# EasyEDA Pro project ProPrj_Desktop_Pet_Dog_V1.3.epro, schematic Schematic1_1
Board Name: Board2_1; Create Date: 2025-08-21; Page Name: Desktop_Pet_P1; Project Name: Desktop_Pet_Dog_V1.2; Schematic Name: Schematic1_1; Update Date: 2025-08-22; Company: 嘉立创EDA; Page Size: A4; Version: V1.0
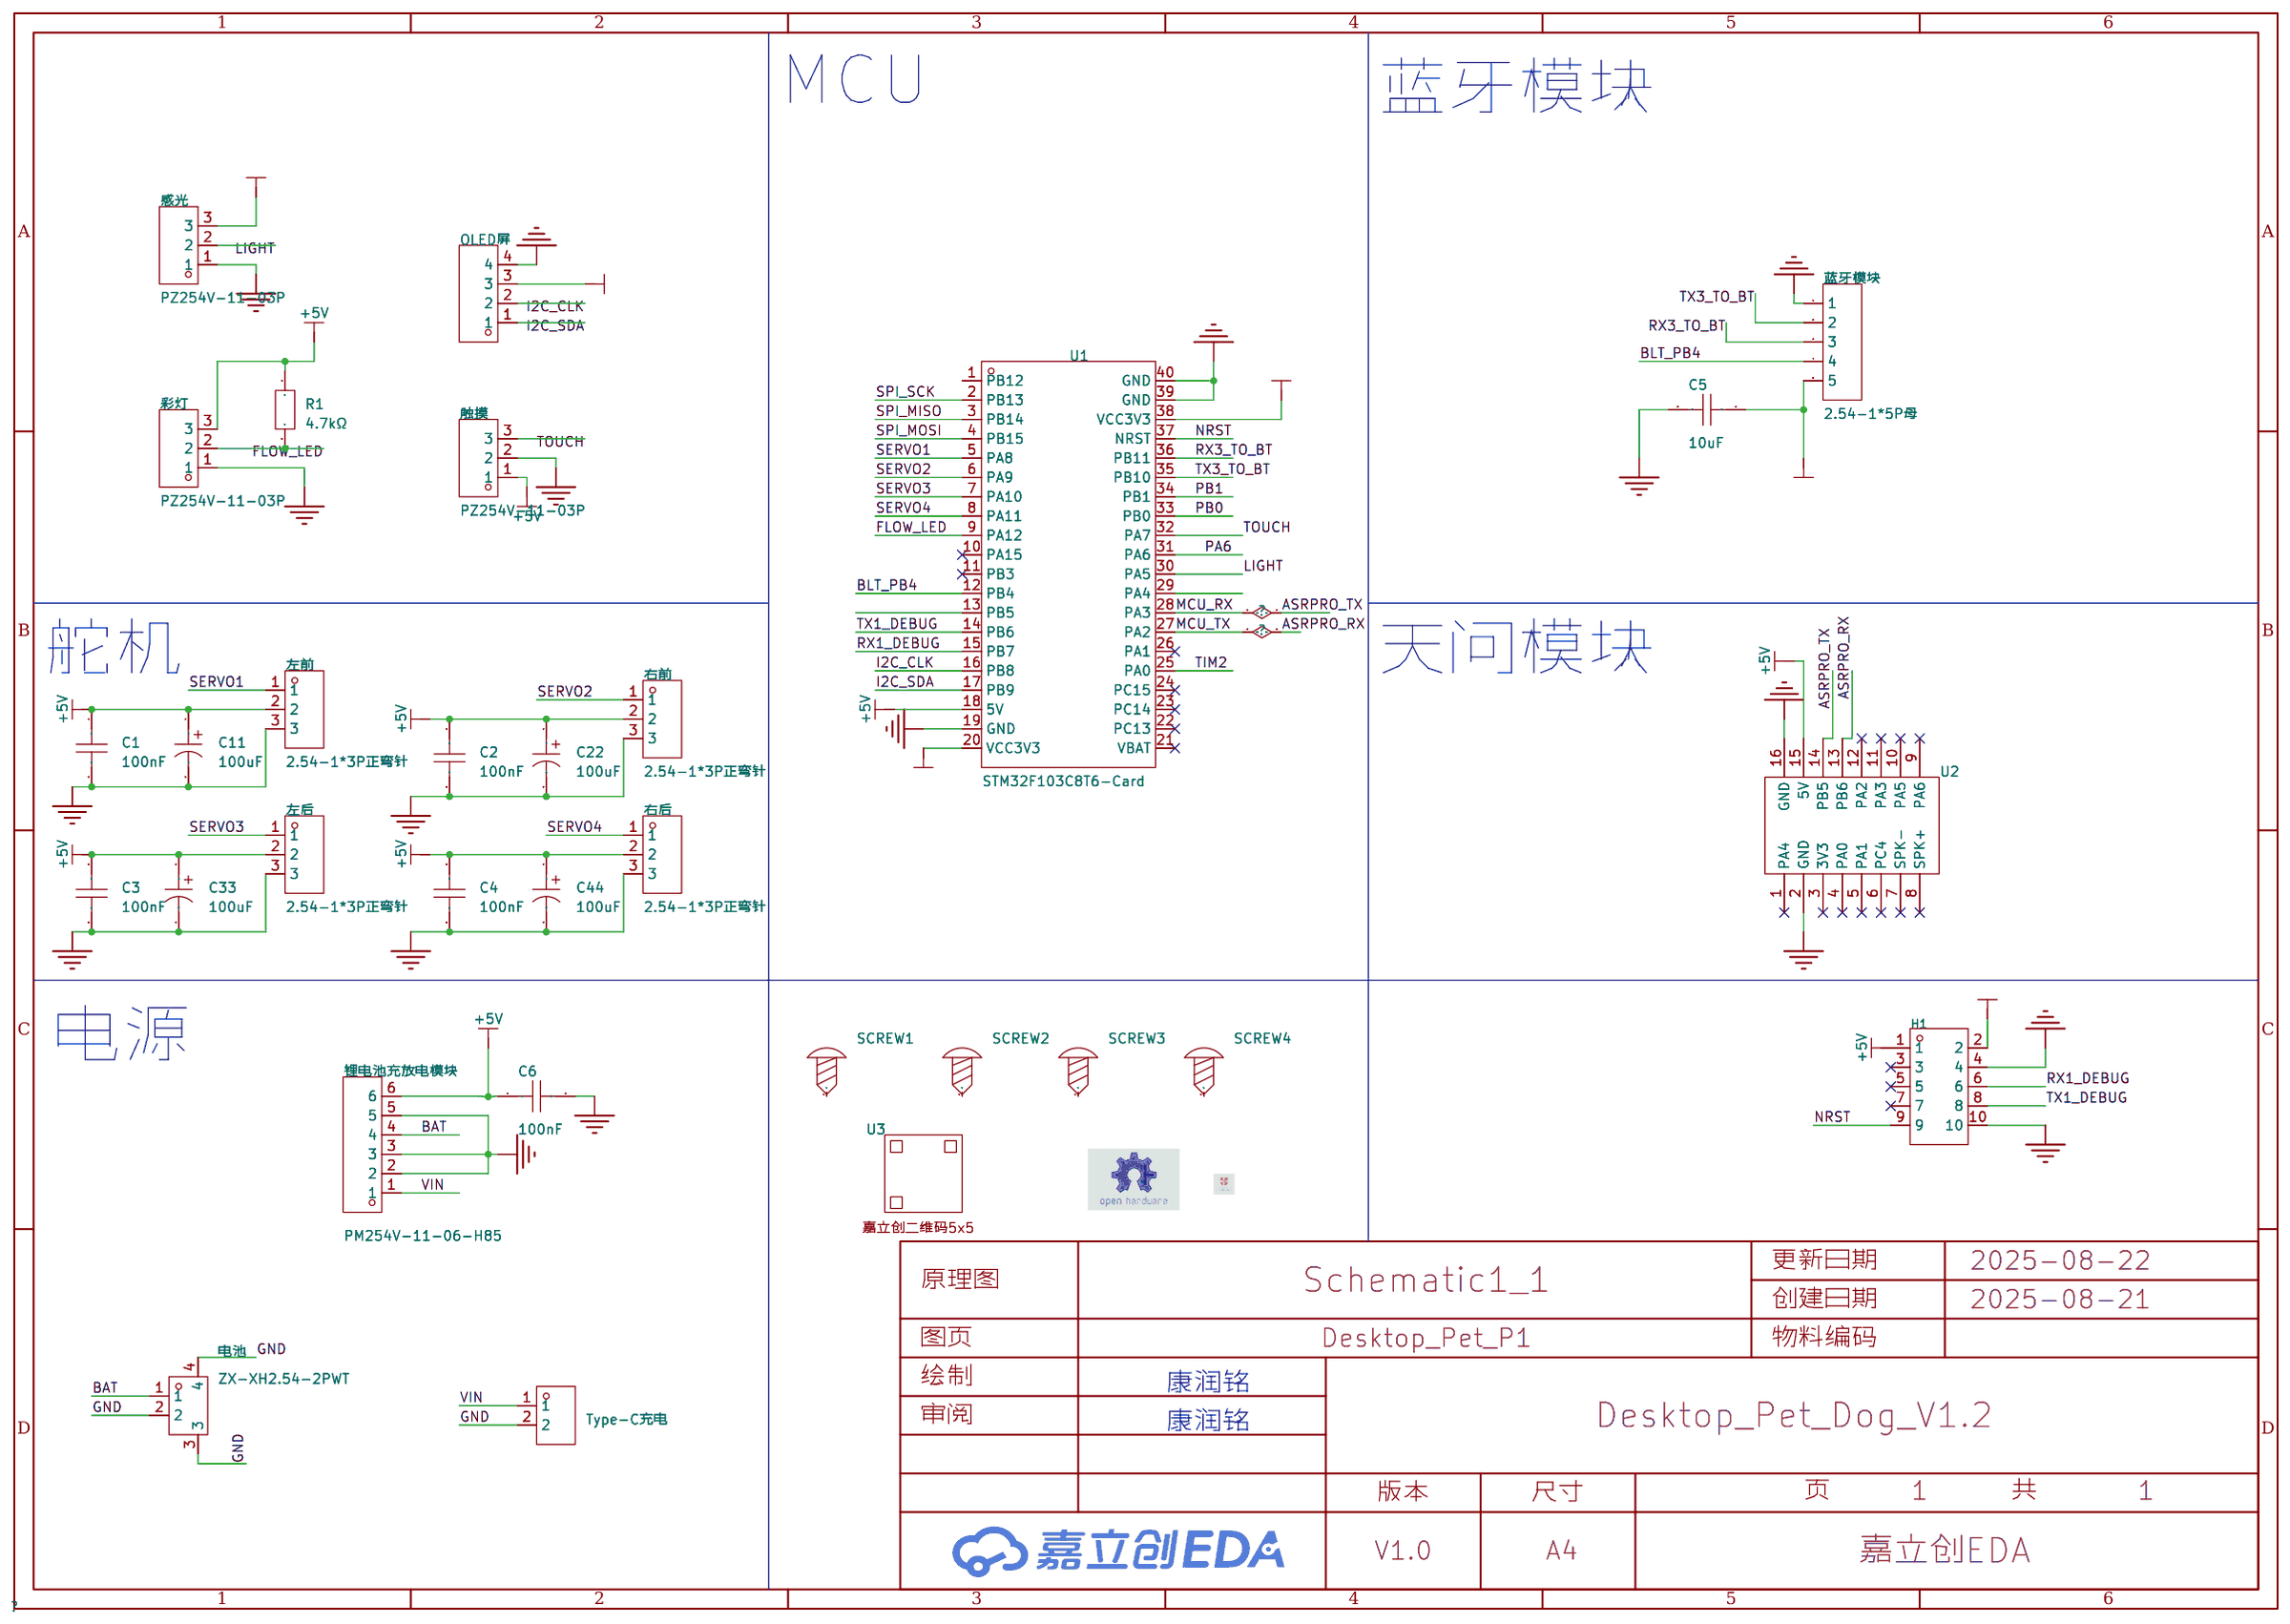
[diagram p1: schematic sheet]

## Parts
C1  100nF  [C0805]
C2  100nF  [C0805]
C3  100nF  [C0805]
C4  100nF  [C0805]
C5  10uF  [C0805]
C6  100nF  [C0805]
C11  100uF  [CAP-TH_BD6.3-P2.50-D0.6-FD]
C22  100uF  [CAP-TH_BD6.3-P2.50-D0.6-FD]
C33  100uF  [CAP-TH_BD6.3-P2.50-D0.6-FD]
C44  100uF  [CAP-TH_BD6.3-P2.50-D0.6-FD]
H1  PZ254V-12-10P  [HDR-TH_10P-P2.54-V-M-R2-C5-S2.54]
OLED屏  -  [HDR-TH_4P-P2.54-V-M]
R1  4.7kΩ  [R0805]
SCREW1  -  [M3螺丝]
SCREW2  -  [M3螺丝]
SCREW3  -  [M3螺丝]
SCREW4  -  [M3螺丝]
Type-C充电  -  [单排针2P-2.54]
U1  STM32F103C8T6-Card  [CONN-TH_L53.3-W22.9_STM32F103C8T6-CARD]
U2  -  [天问模块]
U3  -  [JLC-QRCODE-5x5]
U4  -  [OSHA]
U5  -  [剑桥大学校徽]
右前  2.54-1*3P正弯针  [HDR-TH_3P-P2.54-H-M-BW7.2-P]
右后  2.54-1*3P正弯针  [HDR-TH_3P-P2.54-H-M-BW7.2-P]
左前  2.54-1*3P正弯针  [HDR-TH_3P-P2.54-H-M-BW7.2-P]
左后  2.54-1*3P正弯针  [HDR-TH_3P-P2.54-H-M-BW7.2-P]
彩灯  PZ254V-11-03P  [HDR-TH_3P-P2.54-V-M]
感光  PZ254V-11-03P  [HDR-TH_3P-P2.54-V-M]
电池  ZX-XH2.54-2PWT  [CONN-SMD_2P-P2.54_MEGASTAR_ZX-XH2.54-2PWT]
蓝牙模块  2.54-1*5P母  [HDR-TH_5P-P2.54-V-F]
触摸  PZ254V-11-03P  [HDR-TH_3P-P2.54-V-M]
锂电池充放电模块  PM254V-11-06-H85  [HDR-TH_6P-P2.54-V-F]

## Library data of the parts
C1-C6 = HGC1206R5106K500NSPJ: 容值:10uF;精度:±10%;额定电压:50V;温度系数:X5R;; LCSC Part Name: 10uF ±10% 50V; Supplier Part: C7432781; Manufacturer: Chinocera(华瓷); Supplier Footprint: 1206; JLCPCB Part Class: 扩展库; Datasheet: https://atta.szlcsc.com/upload/public/pdf/source/20240320/FAC3FEC40A78BC5CCCE96C232A94D860.pdf; Supplier: LCSC; Tolerance: ±10%; Voltage Rating: 50V; Temperature Coefficient: X5R
C11 C22 C33 C44 = ERA35V100M6X7: 容值:100uF;精度:±20%;额定电压:35V;; LCSC Part Name: 100uF ±20% 35V; Supplier Part: C49256802; Manufacturer: 捷而瑞; Supplier Footprint: 插件,D6.3xL7mm; JLCPCB Part Class: 扩展库; Datasheet: https://atta.szlcsc.com/upload/public/pdf/source/20250721/91A5FDBF1D56ED1D9DF4096B3DF6E90F.pdf; Supplier: LCSC; Tolerance: ±20%; Voltage Rating: 35V; Pin Spacing: 2.5mm; Diameter: 6mm; Height - Seated (Max): 7mm; Lifetime: 2000hrs@105℃; Operating Temperature: -40℃~+105℃
H1 = PZ254V-12-10P（改成侧插）: 排数:双排;总PIN位数:10;间距:2.54mm;插针结构:2x5P;行距:2.54mm;安装类型:直插;圆针/方针:方针;额定电流:-;额定电压:-;配合针长度:6mm;塑高:2.5mm;端接针长度:3mm;触头材质:黄铜;触头镀层:-;工作温度范围:-40℃~+105℃;颜色:黑色;; LCSC Part Name: 2.54mm 2x5P 直插 方针; Supplier Part: C492422; Manufacturer: XFCN(兴飞); Supplier Footprint: 直插,P=2.54mm; JLCPCB Part Class: 扩展库; Supplier: LCSC; Number of Rows: 双排; Number of Pins: 10; Pitch: 2.54mm; Pin Structure: 2x5P; Row Spacing: 2.54mm; Mounting Type: 直插; Circluar Pins/Square Pins: 方针; Length of Mating Pin: 6mm; Insulation Height: 2.5mm; Length of End Connection Pin: 3mm; Contact Material: 黄铜; Operating Temperature Range: -40℃~+105℃; Color: 黑色
OLED屏 = HDR-M_2.54_1x4P: Supplier Part: C492403; Supplier Footprint: 插件
R1 = RE1206F1R050: 电阻类型:采样电阻;阻值:50mΩ;精度:±1%;功率:1W;温度系数:±50ppm/℃;; LCSC Part Name: 50mΩ 1W 1206 ±1%; Supplier Part: C46961736; Manufacturer: 捷而瑞; Supplier Footprint: 1206; JLCPCB Part Class: 扩展库; Datasheet: https://atta.szlcsc.com/upload/public/pdf/source/20250325/401775B85EF7B3A580BC34DFED100CB2.pdf; Supplier: LCSC; Type: 采样电阻; Tolerance: ±1%; Power(Watts): 1W; Temperature Coefficient: ±50ppm/℃
SCREW1-SCREW4 = M3螺丝: Supplier Footprint: 插件
Type-C充电 = 单塑单排针2p-2.54: 2.54mm 圆孔排针,单排,180度,塑高3.0mm,塑宽2.54mm,D4.3mm,L=12.20mm,PPS料; Datasheet: https://atta.szlcsc.com/upload/public/pdf/source/20211009/7D13F627EAEF227E7F3D2A55C463773D.pdf; Supplier: LCSC
U1 = STM32F103C8T6-Card: Supplier Part: C9900077949; Supplier Footprint: 插件; Supplier: LCSC
U2 = 天问模块
U3 = 嘉立创二维码5x5
U4 = OSHA
U5 = 剑桥校徽
右前 右后 左前 左后 = 2.54-1*3P正弯针: 插针结构:1x3P;间距:2.54mm;行距:-;圆针/方针:方针;安装方式:弯插;排数:单排;总PIN位数:3P;额定电流:3A;额定电压:-;配合针长度:3mm;塑高:2.54mm;端接针长度:-;触头材质:-;触头镀层:-;工作温度:-55℃~+105℃;颜色:黑色;; LCSC Part Name: 1x3P 间距:2.54mm 方针 弯插; Supplier Part: C92159; Manufacturer: BOOMELE(博穆精密); Supplier Footprint: 弯插,P=2.54mm; JLCPCB Part Class: Extended Part; Datasheet: https://atta.szlcsc.com/upload/public/pdf/source/20181121/C2334_B051029C4931EB562F9DCCAAD18AC88A.pdf; Supplier: LCSC; Pin Structure: 1x3P; Pitch: 2.54mm; Circluar Pins/Square Pins: 方针; Mounting Type: 弯插; Number of Rows: 单排; Number of Pins: 3P; Current Rating: 3A; Length of Mating Pin: 3mm; Insulation Height: 2.54mm; Operating Temperature: -55℃~+105℃; Color: 黑色
彩灯 感光 触摸 = PZ254V-11-03P: 插针结构:1x3P;间距:2.54mm;行距:-;圆针/方针:方针;安装类型:直插;排数:单排;总PIN位数:3P;额定电流:3A;额定电压:250V;配合针长度:6mm;塑高:2.5mm;端接针长度:3mm;工作温度范围:-40℃~+105℃;颜色:黑色;; LCSC Part Name: 间距:2.54mm 1x3P 直插 方针; Supplier Part: C2937625; Manufacturer: XFCN(兴飞); Supplier Footprint: 插件,P=2.54mm; JLCPCB Part Class: 扩展库; Datasheet: https://atta.szlcsc.com/upload/public/pdf/source/20200309/C492402_8335C3D49C4E4C618838D59BB1D024C1.pdf; Supplier: LCSC; Pin Structure: 1x3P; Pitch: 2.54mm; Circluar Pins/Square Pins: 方针; Mounting Type: 直插; Number of Rows: 单排; Number of Pins: 3P; Current Rating (Max): 3A; Voltage Rating (Max): 250V; Length of Mating Pin: 6mm; Insulation Height: 2.5mm; Length of End Connection Pin: 3mm; Operating Temperature Range: -40℃~+105℃; Color: 黑色
电池 = ZX-XH2.54-2PWT: 插针结构:1x2P;间距:2.5mm;安装方式:卧贴;参考系列:XH;总PIN数:2P;排数:1;每排PIN数:2;行距:-;额定电流:3A;触头材质:黄铜;触头镀层:锡;工作温度:-25℃~+85℃;; LCSC Part Name: 1x2P 间距:2.5mm 卧贴 系列:XH; Supplier Part: C7429671; Manufacturer: Megastar(兆星); Supplier Footprint: SMD,P=2.5mm,卧贴; JLCPCB Part Class: 扩展库; Datasheet: https://item.szlcsc.com/datasheet/ZX-XH2.54-2PWT/8427588.html; Supplier: LCSC; Pins Structure: 1x2P; Pitch: 2.5mm; Mounting Type: 卧贴; Reference Series: XH; Number of Pins: 2P; Number of Rows: 1; Number of PINs Per Row: 2; Current Rating: 3A; Contact Material: 黄铜; Contact Plating: 锡; Operating Temperature: -25℃~+85℃; Voltage Rating: 250V; Supplementary Features: 辅助焊脚; Color: 米色; Z-Height of the Board: 6.2mm; X-Length of Bottom Edge on Board (Spacing Line): 10mm; Y-Width of Bottom Edge on Board: 10.5mm
蓝牙模块 = 2.54-1*5P母: 插孔结构:1x5P;间距:2.54mm;行距:-;安装方式:直插;排数:单排;总孔位数:5P;塑高:-;触头材质:-;触头镀层:-;; LCSC Part Name: 间距:2.54mm 1x5P 直插; Supplier Part: C50950; Manufacturer: BOOMELE(博穆精密); Supplier Footprint: 插件,P=2.54mm; JLCPCB Part Class: 扩展库; Datasheet: https://atta.szlcsc.com/upload/public/pdf/source/20241114/9CD503F178455EA6594D6395393624BE.pdf; Supplier: LCSC; Holes Structure: 1x5P; Pitch: 2.54mm; Mounting Type: 直插; Number of Rows: 单排; Number of Positions: 5P
锂电池充放电模块 = PM254V-11-06-H85: 插孔结构:1x6P;间距:2.54mm;行距:-;圆孔/方孔:方孔;安装类型:直插;排数:单排;总孔位数:6P;额定电流:3A;额定电压:250V;插孔方向:顶部;塑高:-;工作温度范围:-40℃~+105℃;; LCSC Part Name: 间距:2.54mm 1x6P 直插; Supplier Part: C2832269; Manufacturer: XFCN(兴飞); Supplier Footprint: 插件,P=2.54mm; JLCPCB Part Class: 扩展库; Datasheet: https://atta.szlcsc.com/upload/public/pdf/source/20210514/C2832269_B3EC97736B37C2783BDCE3050AA57447.pdf; Supplier: LCSC; Holes Structure: 1x6P; Pitch: 2.54mm; Circular Hole / Square Hole: 方孔; Mounting Type: 直插; Number of Rows: 单排; Number of Holes: 6P; Current Rating (Max): 3A; Voltage Rating (Max): 250V; Holes Direction: 顶部; Operating Temperature Range: -40℃~+105℃

## Nets
3V3_BT: C5.1 U1.38(VCC3V3) 感光.3 蓝牙模块.5
3V3_OLED: H1.2 OLED屏.3 U1.20(VCC3V3)
+5V: C1.1 C2.1 C3.1 C4.1 C6.1 C11.1 C22.1 C33.1 C44.1 H1.1 R1.1 U1.18(5V) U2.15(5V) 右前.2 右后.2 左前.2 左后.2 彩灯.3 触摸.1 锂电池充放电模块.6
GND: C1.2 C2.2 C3.2 C4.2 C5.2 C6.2 C11.2 C22.2 C33.2 C44.2 H1.4 H1.10 OLED屏.4 Type-C充电.2 U1.19(GND) U1.39(GND) U1.40(GND) U2.2(GND) U2.16(GND) 右前.3 右后.3 左前.3 左后.3 彩灯.1 感光.1 电池.2 电池.3 电池.4 蓝牙模块.1 触摸.2 锂电池充放电模块.2 锂电池充放电模块.3 锂电池充放电模块.5
VIN: Type-C充电.1 锂电池充放电模块.1
ASRPRO_RX: U1.27(PA2) U2.13(PB6)
ASRPRO_TX: U1.28(PA3) U2.14(PB5)
BAT: 电池.1 锂电池充放电模块.4
BLT_PB4: U1.12(PB4) 蓝牙模块.4
FLOW_LED: R1.2 U1.9(PA12) 彩灯.2
I2C_CLK: OLED屏.2 U1.16(PB8)
I2C_SDA: OLED屏.1 U1.17(PB9)
LIGHT: U1.30(PA5) 感光.2
NRST: H1.9 U1.37(NRST)
PA6: U1.31(PA6)
PB0: U1.33(PB0)
PB1: U1.34(PB1)
RX1_DEBUG: H1.6 U1.15(PB7)
RX3_TO_BT: U1.36(PB11) 蓝牙模块.3
SERVO1: U1.5(PA8) 左前.1
SERVO2: U1.6(PA9) 右前.1
SERVO3: U1.7(PA10) 左后.1
SERVO4: U1.8(PA11) 右后.1
SPI_MISO: U1.3(PB14)
SPI_MOSI: U1.4(PB15)
SPI_SCK: U1.2(PB13)
TIM2: U1.25(PA0)
TOUCH: U1.32(PA7) 触摸.3
TX1_DEBUG: H1.8 U1.14(PB6)
TX3_TO_BT: U1.35(PB10) 蓝牙模块.2

Not connected (* = marked no-connect by the designer): H1 3* 5* 7*; SCREW1 1; SCREW2 1; SCREW3 1; SCREW4 1; U1 1(PB12) 10(PA15)* 11(PB3)* 13(PB5) 21(VBAT)* 22(PC13)* 23(PC14)* 24(PC15)* 26(PA1)* 29(PA4); U2 1(PA4)* 3(3V3)* 4(PA0)* 5(PA1)* 6(PC4)* 7(SPK-)* 8(SPK+)* 9(PA6)* 10(PA5)* 11(PA3)* 12(PA2)*

## Notes on the sheet
- MCU
- 蓝牙模块
- 舵机
- 天问模块
- 电源
- 康润铭
- 康润铭
